# Altium project PCB_Project.PrjPcb
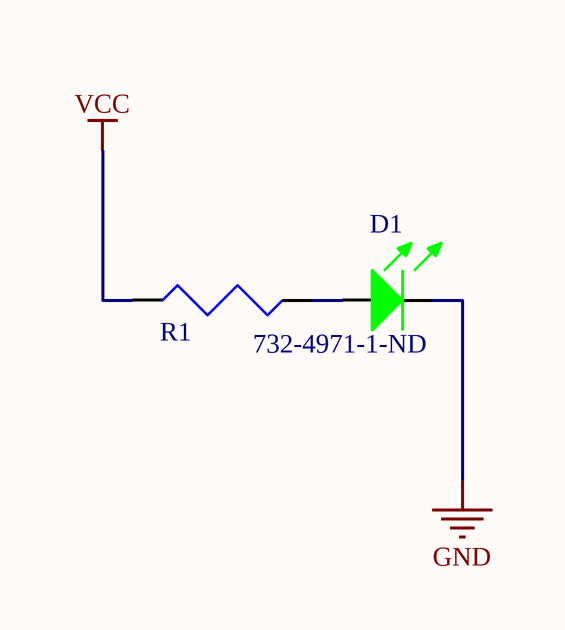
[diagram p0: Test Schematic.SchDoc]
1 sheet, 2 parts. Net scope: global (net labels, ports and power ports of the same name join across sheets).
Board file: Test PCB.PcbDoc

## Sheet Test Schematic.SchDoc
size A; SheetNumber: 1; SheetTotal: 1

### Parts
D1  Supplier Part Number 1: 732-4971-1-ND  [LED_Green_0603_3.2V]  (hidden comment: 150060GS75000)
R1  RK73B1JTTD101J  [PASSIIVE_RESISTOR_0603]  (value not drawn)

### Nets
GND: D1.2
VCC: R1.2
NetD1_1: D1.1 R1.1

### Library data of the parts
D1 = LED_Green_0603_3.2V: LED Green Vf= 3.2V If = 0.025A / 150060GS75000; Supplier 1: Digi-Key; ComponentLink1Description: Datasheet; ComponentLink1URL: https://www.we-online.de/katalog/datasheet/150060GS75000.pdf; Parameter 1: *
R1 = PASSIVE_RESISTOR_100_0603: RES 100 OHM 5% 1/8W 0603; ComponentLink1Description: Digikey; ComponentLink1URL: https://www.digikey.com/en/products/detail/koa-speer-electronics-inc/RK73B1JTTD101J/9844701; Supplier 1: Digi-Key; Supplier Part Number 1: 2019-RK73B1JTTD101JCT-ND